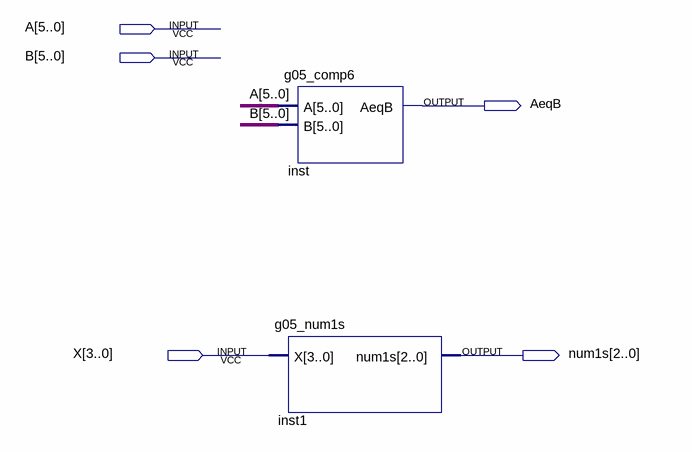
[diagram p0: schematic sheet]
// Quartus schematic g05_lab1.bdf as structural Verilog: 2 symbols, 5 pins
module g05_lab1 (
  input  [5:0] A,
  input  [5:0] B,
  input  [3:0] X,
  output AeqB,
  output [2:0] num1s
);

  g05_comp6 inst (.A(A), .B(B), .AeqB(AeqB));
  g05_num1s inst1 (.X(X), .num1s(num1s));
endmodule
